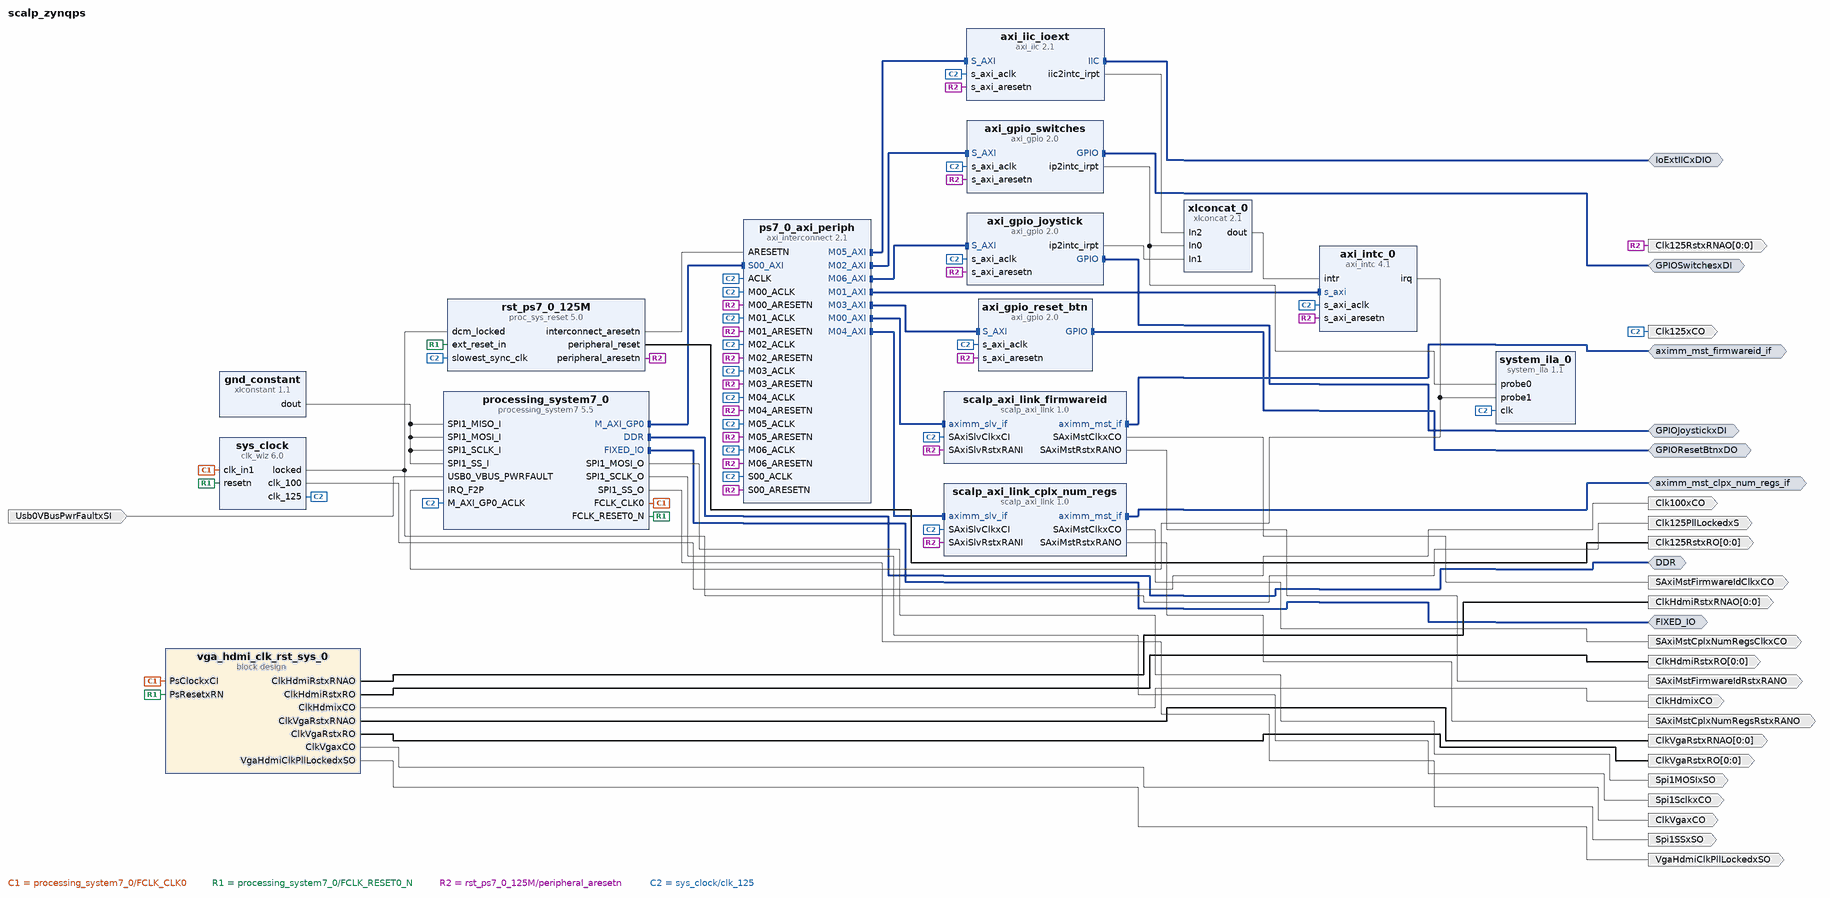
[diagram p0: block diagram of the top level]
# Vivado block design scalp_zynqps, xc7z015clg485-2, Vivado 2025.2
create_bd_design scalp_zynqps

create_bd_intf_port -mode Master -vlnv xilinx.com:interface:ddrx_rtl:1.0 DDR
create_bd_intf_port -mode Master -vlnv xilinx.com:display_processing_system7:fixedio_rtl:1.0 FIXED_IO
create_bd_intf_port -mode Master -vlnv xilinx.com:interface:aximm_rtl:1.0 aximm_mst_firmwareid_if
set_property -dict [list \
  CONFIG.ADDR_WIDTH 32 \
  CONFIG.DATA_WIDTH 32 \
  CONFIG.HAS_BURST 0 \
  CONFIG.HAS_CACHE 0 \
  CONFIG.HAS_LOCK 0 \
  CONFIG.HAS_PROT 0 \
  CONFIG.HAS_QOS 0 \
  CONFIG.HAS_REGION 0 \
  CONFIG.PROTOCOL AXI4LITE \
] [get_bd_intf_ports aximm_mst_firmwareid_if]
create_bd_intf_port -mode Master -vlnv xilinx.com:interface:gpio_rtl:1.0 GPIOSwitchesxDI
create_bd_intf_port -mode Master -vlnv xilinx.com:interface:gpio_rtl:1.0 GPIOResetBtnxDO
create_bd_intf_port -mode Master -vlnv xilinx.com:interface:aximm_rtl:1.0 aximm_mst_clpx_num_regs_if
set_property -dict [list \
  CONFIG.ADDR_WIDTH 32 \
  CONFIG.DATA_WIDTH 32 \
  CONFIG.HAS_BURST 0 \
  CONFIG.HAS_CACHE 0 \
  CONFIG.HAS_LOCK 0 \
  CONFIG.HAS_PROT 0 \
  CONFIG.HAS_QOS 0 \
  CONFIG.HAS_REGION 0 \
  CONFIG.PROTOCOL AXI4LITE \
] [get_bd_intf_ports aximm_mst_clpx_num_regs_if]
create_bd_intf_port -mode Master -vlnv xilinx.com:interface:iic_rtl:1.0 IoExtIICxDIO
create_bd_intf_port -mode Master -vlnv xilinx.com:interface:gpio_rtl:1.0 GPIOJoystickxDI
create_bd_port -dir O Spi1MOSIxSO
create_bd_port -dir O Spi1SSxSO
create_bd_port -dir O Spi1SclkxCO
create_bd_port -dir I Usb0VBusPwrFaultxSI
create_bd_port -dir O -from 0 -to 0 -type rst Clk125RstxRNAO
create_bd_port -dir O -from 0 -to 0 -type rst Clk125RstxRO
create_bd_port -dir O -type clk SAxiMstFirmwareIdClkxCO
set_property -dict {CONFIG.ASSOCIATED_BUSIF aximm_mst_firmwareid_if} [get_bd_ports SAxiMstFirmwareIdClkxCO]
create_bd_port -dir O -type rst SAxiMstFirmwareIdRstxRANO
create_bd_port -dir O -type clk ClkVgaxCO
create_bd_port -dir O -type clk ClkHdmixCO
create_bd_port -dir O -from 0 -to 0 -type rst ClkVgaRstxRO
create_bd_port -dir O -from 0 -to 0 -type rst ClkVgaRstxRNAO
create_bd_port -dir O -from 0 -to 0 -type rst ClkHdmiRstxRO
create_bd_port -dir O -from 0 -to 0 -type rst ClkHdmiRstxRNAO
create_bd_port -dir O Clk125PllLockedxS
create_bd_port -dir O -type clk Clk125xCO
set_property -dict {CONFIG.FREQ_HZ 125000000} [get_bd_ports Clk125xCO]
create_bd_port -dir O -type clk SAxiMstCplxNumRegsClkxCO
create_bd_port -dir O -type rst SAxiMstCplxNumRegsRstxRANO
create_bd_port -dir O VgaHdmiClkPllLockedxSO
create_bd_port -dir O Clk100xCO

create_bd_cell -type ip -vlnv xilinx.com:ip:xlconstant:1.1 gnd_constant
set_property -dict {CONFIG.CONST_VAL 0} [get_bd_cells gnd_constant]
create_bd_cell -type ip -vlnv xilinx.com:ip:processing_system7:5.5 processing_system7_0
set_property -dict [list \
  CONFIG.PCW_APU_PERIPHERAL_FREQMHZ 750 \
  CONFIG.PCW_CAN1_CAN1_IO {MIO 52 .. 53} \
  CONFIG.PCW_CAN1_PERIPHERAL_ENABLE 1 \
  CONFIG.PCW_CPU_CPU_6X4X_MAX_RANGE 767 \
  CONFIG.PCW_CRYSTAL_PERIPHERAL_FREQMHZ 50 \
  CONFIG.PCW_ENET0_ENET0_IO {MIO 16 .. 27} \
  CONFIG.PCW_ENET0_GRP_MDIO_ENABLE 0 \
  CONFIG.PCW_ENET0_PERIPHERAL_ENABLE 1 \
  CONFIG.PCW_ENET0_RESET_ENABLE 0 \
  CONFIG.PCW_ENET_RESET_ENABLE 1 \
  CONFIG.PCW_ENET_RESET_SELECT {Share reset pin} \
  CONFIG.PCW_FPGA0_PERIPHERAL_FREQMHZ 125 \
  CONFIG.PCW_FPGA1_PERIPHERAL_FREQMHZ 50 \
  CONFIG.PCW_GPIO_MIO_GPIO_ENABLE 1 \
  CONFIG.PCW_GPIO_MIO_GPIO_IO MIO \
  CONFIG.PCW_I2C0_GRP_INT_ENABLE 0 \
  CONFIG.PCW_I2C0_I2C0_IO {MIO 50 .. 51} \
  CONFIG.PCW_I2C0_PERIPHERAL_ENABLE 1 \
  CONFIG.PCW_I2C_PERIPHERAL_FREQMHZ 125.000000 \
  CONFIG.PCW_I2C_RESET_ENABLE 1 \
  CONFIG.PCW_I2C_RESET_SELECT {Share reset pin} \
  CONFIG.PCW_IRQ_F2P_INTR 1 \
  CONFIG.PCW_PERIPHERAL_BOARD_PRESET part0 \
  CONFIG.PCW_PRESET_BANK1_VOLTAGE {LVCMOS 2.5V} \
  CONFIG.PCW_QSPI_GRP_SINGLE_SS_ENABLE 1 \
  CONFIG.PCW_QSPI_GRP_SINGLE_SS_IO {MIO 1 .. 6} \
  CONFIG.PCW_QSPI_PERIPHERAL_ENABLE 1 \
  CONFIG.PCW_QSPI_PERIPHERAL_FREQMHZ 133 \
  CONFIG.PCW_QSPI_QSPI_IO {MIO 1 .. 6} \
  CONFIG.PCW_SD0_PERIPHERAL_ENABLE 0 \
  CONFIG.PCW_SD1_GRP_CD_ENABLE 1 \
  CONFIG.PCW_SD1_GRP_CD_IO {MIO 9} \
  CONFIG.PCW_SD1_PERIPHERAL_ENABLE 1 \
  CONFIG.PCW_SD1_SD1_IO {MIO 10 .. 15} \
  CONFIG.PCW_SDIO_PERIPHERAL_FREQMHZ 100 \
  CONFIG.PCW_SINGLE_QSPI_DATA_MODE x4 \
  CONFIG.PCW_SPI0_PERIPHERAL_ENABLE 1 \
  CONFIG.PCW_SPI0_SPI0_IO {MIO 40 .. 45} \
  CONFIG.PCW_SPI1_PERIPHERAL_ENABLE 1 \
  CONFIG.PCW_SPI1_SPI1_IO EMIO \
  CONFIG.PCW_UART0_PERIPHERAL_ENABLE 1 \
  CONFIG.PCW_UART0_UART0_IO {MIO 46 .. 47} \
  CONFIG.PCW_UART1_PERIPHERAL_ENABLE 1 \
  CONFIG.PCW_UART1_UART1_IO {MIO 48 .. 49} \
  CONFIG.PCW_UART_PERIPHERAL_FREQMHZ 100 \
  CONFIG.PCW_UIPARAM_DDR_BUS_WIDTH {16 Bit} \
  CONFIG.PCW_UIPARAM_DDR_FREQ_MHZ 500 \
  CONFIG.PCW_UIPARAM_DDR_MEMORY_TYPE {DDR 3 (Low Voltage)} \
  CONFIG.PCW_UIPARAM_DDR_PARTNO {MT41K128M16 JT-125} \
  CONFIG.PCW_USB0_PERIPHERAL_ENABLE 1 \
  CONFIG.PCW_USB0_RESET_ENABLE 0 \
  CONFIG.PCW_USB0_USB0_IO {MIO 28 .. 39} \
  CONFIG.PCW_USB_RESET_ENABLE 1 \
  CONFIG.PCW_USB_RESET_SELECT {Share reset pin} \
  CONFIG.PCW_USE_FABRIC_INTERRUPT 1 \
] [get_bd_cells processing_system7_0]
# 520 more settings of processing_system7_0 are not shown: defaults, MIO pin electricals, DDR timing, and values the tool derives
create_bd_cell -type ip -vlnv hepia.hesge.ch:user:scalp_axi_link:1.0 scalp_axi_link_firmwareid
create_bd_cell -type ip -vlnv xilinx.com:ip:axi_interconnect:2.1 ps7_0_axi_periph
set_property -dict {CONFIG.NUM_MI 7} [get_bd_cells ps7_0_axi_periph]
create_bd_cell -type ip -vlnv xilinx.com:ip:axi_gpio:2.0 axi_gpio_switches
set_property -dict {CONFIG.C_ALL_INPUTS 1 CONFIG.C_GPIO_WIDTH 2 CONFIG.C_INTERRUPT_PRESENT 1} [get_bd_cells axi_gpio_switches]
create_bd_cell -type ip -vlnv xilinx.com:ip:axi_intc:4.1 axi_intc_0
set_property -dict {CONFIG.C_IRQ_CONNECTION 1} [get_bd_cells axi_intc_0]
create_bd_cell -type ip -vlnv xilinx.com:ip:xlconcat:2.1 xlconcat_0
set_property -dict {CONFIG.NUM_PORTS 3 CONFIG.dout_width 3} [get_bd_cells xlconcat_0]
create_bd_cell -type ip -vlnv xilinx.com:ip:axi_gpio:2.0 axi_gpio_reset_btn
set_property -dict [list \
  CONFIG.C_ALL_INPUTS 0 \
  CONFIG.C_ALL_OUTPUTS 1 \
  CONFIG.C_GPIO_WIDTH 1 \
  CONFIG.C_INTERRUPT_PRESENT 0 \
] [get_bd_cells axi_gpio_reset_btn]
create_bd_cell -type ip -vlnv xilinx.com:ip:system_ila:1.1 system_ila_0
set_property -dict [list \
  CONFIG.C_MON_TYPE NATIVE \
  CONFIG.C_NUM_OF_PROBES 2 \
  CONFIG.C_PROBE0_TYPE 0 \
  CONFIG.C_PROBE1_TYPE 0 \
] [get_bd_cells system_ila_0]
create_bd_cell -type ip -vlnv hepia.hesge.ch:user:scalp_axi_link:1.0 scalp_axi_link_cplx_num_regs
create_bd_cell -type container -reference vga_hdmi_clk_rst_system vga_hdmi_clk_rst_sys_0
set_property -dict [list \
  CONFIG.ACTIVE_SIM_BD vga_hdmi_clk_rst_system.bd \
  CONFIG.ACTIVE_SYNTH_BD vga_hdmi_clk_rst_system.bd \
  CONFIG.ENABLE_DFX 0 \
  CONFIG.LIST_SIM_BD vga_hdmi_clk_rst_system.bd \
  CONFIG.LIST_SYNTH_BD vga_hdmi_clk_rst_system.bd \
  CONFIG.LOCK_PROPAGATE 0 \
] [get_bd_cells vga_hdmi_clk_rst_sys_0]
create_bd_cell -type ip -vlnv xilinx.com:ip:proc_sys_reset:5.0 rst_ps7_0_125M
create_bd_cell -type ip -vlnv xilinx.com:ip:clk_wiz:6.0 sys_clock
set_property -dict [list \
  CONFIG.CLKIN1_JITTER_PS 80.0 \
  CONFIG.CLKOUT1_JITTER 119.348 \
  CONFIG.CLKOUT1_PHASE_ERROR 96.948 \
  CONFIG.CLKOUT1_REQUESTED_OUT_FREQ 125 \
  CONFIG.CLKOUT1_USED true \
  CONFIG.CLKOUT2_JITTER 124.615 \
  CONFIG.CLKOUT2_PHASE_ERROR 96.948 \
  CONFIG.CLKOUT2_REQUESTED_OUT_FREQ 100.000 \
  CONFIG.CLKOUT2_USED true \
  CONFIG.CLKOUT3_JITTER 100.399 \
  CONFIG.CLKOUT3_PHASE_ERROR 86.876 \
  CONFIG.CLKOUT3_REQUESTED_OUT_FREQ 100.000 \
  CONFIG.CLKOUT3_USED false \
  CONFIG.CLKOUT4_JITTER 150.677 \
  CONFIG.CLKOUT4_PHASE_ERROR 214.542 \
  CONFIG.CLKOUT4_REQUESTED_OUT_FREQ 100.000 \
  CONFIG.CLKOUT4_USED false \
  CONFIG.CLK_OUT1_PORT clk_125 \
  CONFIG.CLK_OUT2_PORT clk_100 \
  CONFIG.CLK_OUT3_PORT clk_out3 \
  CONFIG.CLK_OUT4_PORT clk_out4 \
  CONFIG.MMCM_CLKFBOUT_MULT_F 8.000 \
  CONFIG.MMCM_CLKIN1_PERIOD 8.000 \
  CONFIG.MMCM_CLKOUT0_DIVIDE_F 8.000 \
  CONFIG.MMCM_CLKOUT1_DIVIDE 10 \
  CONFIG.MMCM_CLKOUT2_DIVIDE 1 \
  CONFIG.MMCM_CLKOUT3_DIVIDE 1 \
  CONFIG.MMCM_DIVCLK_DIVIDE 1 \
  CONFIG.NUM_OUT_CLKS 2 \
  CONFIG.PRIM_SOURCE Global_buffer \
  CONFIG.RESET_PORT resetn \
  CONFIG.RESET_TYPE ACTIVE_LOW \
] [get_bd_cells sys_clock]
create_bd_cell -type ip -vlnv xilinx.com:ip:axi_iic:2.1 axi_iic_ioext
create_bd_cell -type ip -vlnv xilinx.com:ip:axi_gpio:2.0 axi_gpio_joystick
set_property -dict {CONFIG.C_ALL_INPUTS 1 CONFIG.C_GPIO_WIDTH 5 CONFIG.C_INTERRUPT_PRESENT 1} [get_bd_cells axi_gpio_joystick]

# ---- connections ----

connect_bd_intf_net -intf_net axi_gpio_0_GPIO [get_bd_intf_ports GPIOSwitchesxDI] [get_bd_intf_pins axi_gpio_switches/GPIO]
connect_bd_intf_net [get_bd_intf_ports GPIOJoystickxDI] [get_bd_intf_pins axi_gpio_joystick/GPIO]
connect_bd_intf_net [get_bd_intf_ports GPIOResetBtnxDO] [get_bd_intf_pins axi_gpio_reset_btn/GPIO]
connect_bd_intf_net -intf_net axi_iic_joystick_0_IIC [get_bd_intf_ports IoExtIICxDIO] [get_bd_intf_pins axi_iic_ioext/IIC]
connect_bd_intf_net [get_bd_intf_ports DDR] [get_bd_intf_pins processing_system7_0/DDR]
connect_bd_intf_net [get_bd_intf_ports FIXED_IO] [get_bd_intf_pins processing_system7_0/FIXED_IO]
connect_bd_intf_net [get_bd_intf_pins processing_system7_0/M_AXI_GP0] [get_bd_intf_pins ps7_0_axi_periph/S00_AXI]
connect_bd_intf_net [get_bd_intf_pins ps7_0_axi_periph/M00_AXI] [get_bd_intf_pins scalp_axi_link_firmwareid/aximm_slv_if]
connect_bd_intf_net [get_bd_intf_pins ps7_0_axi_periph/M01_AXI] [get_bd_intf_pins axi_intc_0/s_axi]
connect_bd_intf_net [get_bd_intf_pins ps7_0_axi_periph/M02_AXI] [get_bd_intf_pins axi_gpio_switches/S_AXI]
connect_bd_intf_net [get_bd_intf_pins ps7_0_axi_periph/M03_AXI] [get_bd_intf_pins axi_gpio_reset_btn/S_AXI]
connect_bd_intf_net [get_bd_intf_pins ps7_0_axi_periph/M04_AXI] [get_bd_intf_pins scalp_axi_link_cplx_num_regs/aximm_slv_if]
connect_bd_intf_net [get_bd_intf_pins ps7_0_axi_periph/M05_AXI] [get_bd_intf_pins axi_iic_ioext/S_AXI]
connect_bd_intf_net [get_bd_intf_pins ps7_0_axi_periph/M06_AXI] [get_bd_intf_pins axi_gpio_joystick/S_AXI]
connect_bd_intf_net -intf_net scalp_axi_link_0_aximm_mst_if [get_bd_intf_ports aximm_mst_firmwareid_if] [get_bd_intf_pins scalp_axi_link_firmwareid/aximm_mst_if]
connect_bd_intf_net [get_bd_intf_ports aximm_mst_clpx_num_regs_if] [get_bd_intf_pins scalp_axi_link_cplx_num_regs/aximm_mst_if]
connect_bd_net -net USB0_VBUS_PWRFAULT_0_1 [get_bd_ports Usb0VBusPwrFaultxSI] [get_bd_pins processing_system7_0/USB0_VBUS_PWRFAULT]
connect_bd_net -net axi_gpio_0_ip2intc_irpt [get_bd_pins axi_gpio_switches/ip2intc_irpt] \
  [get_bd_pins system_ila_0/probe0] [get_bd_pins xlconcat_0/In0]
connect_bd_net [get_bd_pins axi_gpio_joystick/ip2intc_irpt] [get_bd_pins xlconcat_0/In1]
connect_bd_net [get_bd_pins axi_iic_ioext/iic2intc_irpt] [get_bd_pins xlconcat_0/In2]
connect_bd_net -net axi_intc_0_irq [get_bd_pins axi_intc_0/irq] [get_bd_pins processing_system7_0/IRQ_F2P] [get_bd_pins system_ila_0/probe1]
connect_bd_net [get_bd_pins gnd_constant/dout] \
  [get_bd_pins processing_system7_0/SPI1_SCLK_I] [get_bd_pins processing_system7_0/SPI1_MOSI_I] \
  [get_bd_pins processing_system7_0/SPI1_MISO_I] [get_bd_pins processing_system7_0/SPI1_SS_I]
connect_bd_net [get_bd_pins processing_system7_0/FCLK_CLK0] [get_bd_pins vga_hdmi_clk_rst_sys_0/PsClockxCI] [get_bd_pins sys_clock/clk_in1]
connect_bd_net [get_bd_pins processing_system7_0/FCLK_RESET0_N] \
  [get_bd_pins vga_hdmi_clk_rst_sys_0/PsResetxRN] [get_bd_pins rst_ps7_0_125M/ext_reset_in] [get_bd_pins sys_clock/resetn]
connect_bd_net [get_bd_pins processing_system7_0/SPI1_MOSI_O] [get_bd_ports Spi1MOSIxSO]
connect_bd_net [get_bd_pins processing_system7_0/SPI1_SCLK_O] [get_bd_ports Spi1SclkxCO]
connect_bd_net [get_bd_pins processing_system7_0/SPI1_SS_O] [get_bd_ports Spi1SSxSO]
connect_bd_net [get_bd_pins rst_ps7_0_125M/interconnect_aresetn] [get_bd_pins ps7_0_axi_periph/ARESETN]
connect_bd_net [get_bd_pins rst_ps7_0_125M/peripheral_aresetn] \
  [get_bd_ports Clk125RstxRNAO] [get_bd_pins scalp_axi_link_firmwareid/SAxiSlvRstxRANI] \
  [get_bd_pins scalp_axi_link_cplx_num_regs/SAxiSlvRstxRANI] [get_bd_pins axi_gpio_joystick/s_axi_aresetn] \
  [get_bd_pins axi_gpio_reset_btn/s_axi_aresetn] [get_bd_pins axi_gpio_switches/s_axi_aresetn] \
  [get_bd_pins axi_iic_ioext/s_axi_aresetn] [get_bd_pins axi_intc_0/s_axi_aresetn] [get_bd_pins ps7_0_axi_periph/S00_ARESETN] \
  [get_bd_pins ps7_0_axi_periph/M00_ARESETN] [get_bd_pins ps7_0_axi_periph/M01_ARESETN] \
  [get_bd_pins ps7_0_axi_periph/M02_ARESETN] [get_bd_pins ps7_0_axi_periph/M03_ARESETN] \
  [get_bd_pins ps7_0_axi_periph/M04_ARESETN] [get_bd_pins ps7_0_axi_periph/M05_ARESETN] \
  [get_bd_pins ps7_0_axi_periph/M06_ARESETN]
connect_bd_net [get_bd_pins rst_ps7_0_125M/peripheral_reset] [get_bd_ports Clk125RstxRO]
connect_bd_net -net scalp_axi_link_0_SAxiMstClkxCO [get_bd_pins scalp_axi_link_firmwareid/SAxiMstClkxCO] [get_bd_ports SAxiMstFirmwareIdClkxCO]
connect_bd_net -net scalp_axi_link_0_SAxiMstRstxRANO [get_bd_pins scalp_axi_link_firmwareid/SAxiMstRstxRANO] [get_bd_ports SAxiMstFirmwareIdRstxRANO]
connect_bd_net [get_bd_pins scalp_axi_link_cplx_num_regs/SAxiMstClkxCO] [get_bd_ports SAxiMstCplxNumRegsClkxCO]
connect_bd_net [get_bd_pins scalp_axi_link_cplx_num_regs/SAxiMstRstxRANO] [get_bd_ports SAxiMstCplxNumRegsRstxRANO]
connect_bd_net [get_bd_pins sys_clock/clk_100] [get_bd_ports Clk100xCO]
connect_bd_net [get_bd_pins sys_clock/clk_125] \
  [get_bd_pins scalp_axi_link_firmwareid/SAxiSlvClkxCI] [get_bd_ports Clk125xCO] \
  [get_bd_pins scalp_axi_link_cplx_num_regs/SAxiSlvClkxCI] [get_bd_pins axi_gpio_joystick/s_axi_aclk] \
  [get_bd_pins axi_gpio_reset_btn/s_axi_aclk] [get_bd_pins axi_gpio_switches/s_axi_aclk] \
  [get_bd_pins axi_iic_ioext/s_axi_aclk] [get_bd_pins axi_intc_0/s_axi_aclk] \
  [get_bd_pins processing_system7_0/M_AXI_GP0_ACLK] [get_bd_pins ps7_0_axi_periph/ACLK] \
  [get_bd_pins ps7_0_axi_periph/S00_ACLK] [get_bd_pins ps7_0_axi_periph/M00_ACLK] [get_bd_pins ps7_0_axi_periph/M01_ACLK] \
  [get_bd_pins ps7_0_axi_periph/M02_ACLK] [get_bd_pins ps7_0_axi_periph/M03_ACLK] [get_bd_pins ps7_0_axi_periph/M04_ACLK] \
  [get_bd_pins ps7_0_axi_periph/M05_ACLK] [get_bd_pins ps7_0_axi_periph/M06_ACLK] \
  [get_bd_pins rst_ps7_0_125M/slowest_sync_clk] [get_bd_pins system_ila_0/clk]
connect_bd_net [get_bd_pins sys_clock/locked] [get_bd_ports Clk125PllLockedxS] [get_bd_pins rst_ps7_0_125M/dcm_locked]
connect_bd_net [get_bd_pins vga_hdmi_clk_rst_sys_0/ClkHdmiRstxRNAO] [get_bd_ports ClkHdmiRstxRNAO]
connect_bd_net [get_bd_pins vga_hdmi_clk_rst_sys_0/ClkHdmiRstxRO] [get_bd_ports ClkHdmiRstxRO]
connect_bd_net [get_bd_pins vga_hdmi_clk_rst_sys_0/ClkHdmixCO] [get_bd_ports ClkHdmixCO]
connect_bd_net [get_bd_pins vga_hdmi_clk_rst_sys_0/ClkVgaRstxRNAO] [get_bd_ports ClkVgaRstxRNAO]
connect_bd_net [get_bd_pins vga_hdmi_clk_rst_sys_0/ClkVgaRstxRO] [get_bd_ports ClkVgaRstxRO]
connect_bd_net [get_bd_pins vga_hdmi_clk_rst_sys_0/ClkVgaxCO] [get_bd_ports ClkVgaxCO]
connect_bd_net [get_bd_pins vga_hdmi_clk_rst_sys_0/VgaHdmiClkPllLockedxSO] [get_bd_ports VgaHdmiClkPllLockedxSO]
connect_bd_net [get_bd_pins xlconcat_0/dout] [get_bd_pins axi_intc_0/intr]
set_property PFM.AXI_PORT {M_AXI_GP1 {memport "M_AXI_GP" sptag "" memory "" is_range "false"} S_AXI_HP0 {memport "S_AXI_HP" sptag "" memory "" is_range "false"} S_AXI_HP1 {memport "S_AXI_HP" sptag "" memory "" is_range "false"} S_AXI_HP2 {memport "S_AXI_HP" sptag "" memory "" is_range "false"} S_AXI_HP3 {memport "S_AXI_HP" sptag "" memory "" is_range "false"}} [get_bd_cells processing_system7_0]
set_property PFM.AXI_PORT {M07_AXI { memport "M_AXI_GP" sptag "" memory "" is_range "false" } M08_AXI { memport "M_AXI_GP" sptag "" memory "" is_range "false" } M09_AXI { memport "M_AXI_GP" sptag "" memory "" is_range "false" } M10_AXI { memport "M_AXI_GP" sptag "" memory "" is_range "false" } M11_AXI { memport "M_AXI_GP" sptag "" memory "" is_range "false" } M12_AXI { memport "M_AXI_GP" sptag "" memory "" is_range "false" } } [get_bd_cells ps7_0_axi_periph]
set_property PFM.CLOCK {clk_125 {id "2" is_default "true" proc_sys_reset "/rst_ps7_0_125M" status "fixed" freq_hz "125000000"}} [get_bd_cells sys_clock]
set_property HDL_ATTRIBUTE.DEBUG true [get_bd_nets axi_gpio_0_ip2intc_irpt]
set_property HDL_ATTRIBUTE.MARK_DEBUG true [get_bd_nets axi_gpio_0_ip2intc_irpt]
set_property HDL_ATTRIBUTE.DEBUG true [get_bd_nets axi_intc_0_irq]
set_property HDL_ATTRIBUTE.MARK_DEBUG true [get_bd_nets axi_intc_0_irq]

# ---- address map ----
assign_bd_address -offset 0x41200000 -range 64K -target_address_space [get_bd_addr_spaces processing_system7_0/Data] [get_bd_addr_segs axi_gpio_switches/S_AXI/Reg]
assign_bd_address -offset 0x41210000 -range 64K -target_address_space [get_bd_addr_spaces processing_system7_0/Data] [get_bd_addr_segs axi_gpio_reset_btn/S_AXI/Reg]
assign_bd_address -offset 0x41220000 -range 64K -target_address_space [get_bd_addr_spaces processing_system7_0/Data] [get_bd_addr_segs axi_gpio_joystick/S_AXI/Reg]
assign_bd_address -offset 0x41600000 -range 64K -target_address_space [get_bd_addr_spaces processing_system7_0/Data] [get_bd_addr_segs axi_iic_ioext/S_AXI/Reg]
assign_bd_address -offset 0x41800000 -range 64K -target_address_space [get_bd_addr_spaces processing_system7_0/Data] [get_bd_addr_segs axi_intc_0/S_AXI/Reg]
assign_bd_address -offset 0x43C00000 -range 4K -target_address_space [get_bd_addr_spaces processing_system7_0/Data] [get_bd_addr_segs scalp_axi_link_firmwareid/aximm_slv_if/Reg]
assign_bd_address -offset 0x43C10000 -range 4K -target_address_space [get_bd_addr_spaces processing_system7_0/Data] [get_bd_addr_segs scalp_axi_link_cplx_num_regs/aximm_slv_if/Reg]

set_property USER_COMMENTS.comment_0 {According to screen resolution, 
the clock frequencies can be 
modified. } [get_bd_cells /vga_hdmi_clk_rst_sys_0]

validate_bd_design
save_bd_design
